# Altium schematic sheet Analog_input.SchDoc
size A; SheetNumber: 5; SheetTotal: 6
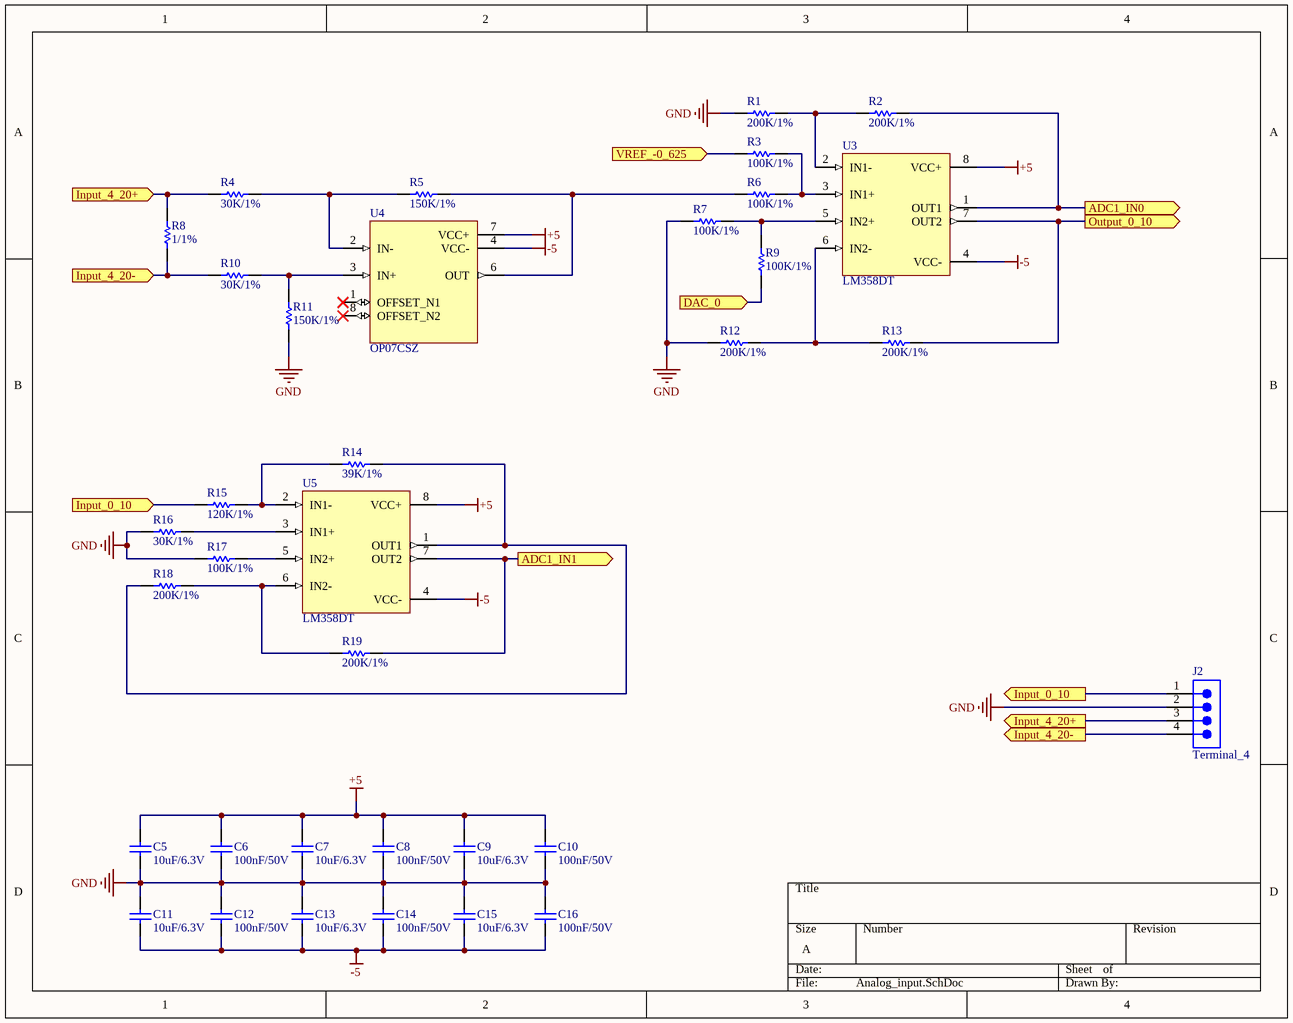
[diagram p0: Analog_input.SchDoc]

## Parts
C5  10uF/6.3V  [CAP_0805]
C6  100nF/50V  [CAP_0805]
C7  10uF/6.3V  [CAP_0805]
C8  100nF/50V  [CAP_0805]
C9  10uF/6.3V  [CAP_0805]
C10  100nF/50V  [CAP_0805]
C11  10uF/6.3V  [CAP_0805]
C12  100nF/50V  [CAP_0805]
C13  10uF/6.3V  [CAP_0805]
C14  100nF/50V  [CAP_0805]
C15  10uF/6.3V  [CAP_0805]
C16  100nF/50V  [CAP_0805]
J2  Terminal_4  [TBL_4_3_81]
R1  200K/1%  [RES_0805]
R2  200K/1%  [RES_0805]
R3  100K/1%  [RES_0805]
R4  30K/1%  [RES_0805]
R5  150K/1%  [RES_0603]
R6  100K/1%  [RES_0805]
R7  100K/1%  [RES_0805]
R8  1/1%  [RES_0805]
R9  100K/1%  [RES_0805]
R10  30K/1%  [RES_0805]
R11  150K/1%  [RES_0805]
R12  200K/1%  [RES_0805]
R13  200K/1%  [RES_0805]
R14  39K/1%  [RES_0805]
R15  120K/1%  [RES_0805]
R16  30K/1%  [RES_0805]
R17  100K/1%  [RES_0805]
R18  200K/1%  [RES_0805]
R19  200K/1%  [RES_0805]
U3  LM358DT  [SOIC127P600X175-8N]
U4  OP07CSZ  [SOIC127P600X175-8N]
U5  LM358DT  [SOIC127P600X175-8N]

## Ports
ADC1_IN0 (out), ADC1_IN1 (out), DAC_0 (in), Input_0_10 (in), Input_0_10 (out), Input_4_20+ (in), Input_4_20+ (out), Input_4_20- (in), Input_4_20- (out), Output_0_10 (out), VREF_-0_625 (in)

## Nets
+5: C5.2 C6.2 C7.2 C8.2 C9.2 C10.2 U3.8(VCC+) U4.7(VCC+) U5.8(VCC+)
-5: C11.1 C12.1 C13.1 C14.1 C15.1 C16.1 U3.4(VCC-) U4.4(VCC-) U5.4(VCC-)
GND: C5.1 C6.1 C7.1 C8.1 C9.1 C10.1 C11.2 C12.2 C13.2 C14.2 C15.2 C16.2 J2.2 R1.1 R7.1 R11.1 R12.1 R16.1 R17.1
ADC1_IN0: R2.2 U3.1(OUT1) ; port ADC1_IN0
ADC1_IN1: R19.2 U5.7(OUT2) ; port ADC1_IN1
DAC_0: R9.1 ; port DAC_0
Input_0_10: J2.1 R15.1 ; port Input_0_10
Input_4_20+: J2.3 R4.1 R8.2 ; port Input_4_20+
Input_4_20-: J2.4 R8.1 R10.1 ; port Input_4_20-
Output_0_10: R13.2 U3.7(OUT2) ; port Output_0_10
VREF_-0_625: R3.1 ; port VREF_-0_625
NetR1_2: R1.2 R2.1 U3.2(IN1-)
NetR3_2: R3.2 R6.2 U3.3(IN1+)
NetR4_2: R4.2 R5.1 U4.2(IN-)
NetR5_2: R5.2 R6.1 U4.6(OUT)
NetR7_2: R7.2 R9.2 U3.5(IN2+)
NetR10_2: R10.2 R11.2 U4.3(IN+)
NetR12_2: R12.2 R13.1 U3.6(IN2-)
NetR14_1: R14.1 R15.2 U5.2(IN1-)
NetR14_2: R14.2 R18.1 U5.1(OUT1)
NetR16_2: R16.2 U5.3(IN1+)
NetR17_2: R17.2 U5.5(IN2+)
NetR18_2: R18.2 R19.1 U5.6(IN2-)

Not connected (* = marked no-connect by the designer): U4 1(OFFSET_N1)* 8(OFFSET_N2)*

## Library data of the parts
C5-C16 = Capacitor: Size: 0805
  C5 C7 C9 C11 C13 C15: URL: https://www.thegioiic.com/tu-gom-0805-10uf-6-3v; Value: 10uF/6.3V
  C6 C8 C10 C12 C14 C16: URL: https://www.thegioiic.com/tu-gom-0805-100nf-0-1uf-50v; Value: 100nF/50V
J2 = Terminal_4: Value: 20A, 300V
R1-R19 = Resistor: Size: 0805
  R1 R2 R12 R13 R18 R19: URL: https://www.thegioiic.com/dien-tro-200-kohm-0805-1-; Value: 200K/1%
  R3 R6 R7 R9 R17: URL: https://www.thegioiic.com/dien-tro-100-kohm-0805-1-; Value: 100K/1%
  R4 R10 R16: URL: https://www.thegioiic.com/dien-tro-30-kohm-0805-1-; Value: 30K/1%
  R5 R11: URL: https://www.thegioiic.com/dien-tro-150-kohm-0805-1-; Value: 150K/1%
  R8: URL: https://www.thegioiic.com/dien-tro-1-ohm-0805-1-https://www.thegioiic.com/dien-tro-1-ohm-0805-1-; Value: 1/1%
  R14: URL: https://www.thegioiic.com/dien-tro-39-kohm-0805-1-; Value: 39K/1%
  R15: URL: https://www.thegioiic.com/dien-tro-120-kohm-0805-1-; Value: 120K/1%
U3 U5 = LM358DT: General Purpose Amplifier 2 Circuit 8-SO; Size: 8-SOIC; URL: https://www.thegioiic.com/lm358dt-ic-opamp-general-purpose-amplifier-2-circuit-1-1mhz-8-soic; Value: LM358DT
U4 = OP07CSZ: Low-Offset Voltage Operational Amplifier; Size: 8-SOIC; URL: https://www.thegioiic.com/op07csz-ic-opamp-general-purpose-amplifier-1-circuit-600khz-8-soic; Value: OP07CSZ